# EAGLE board matrix2 (EAGLE 5.10), part 1 of 2
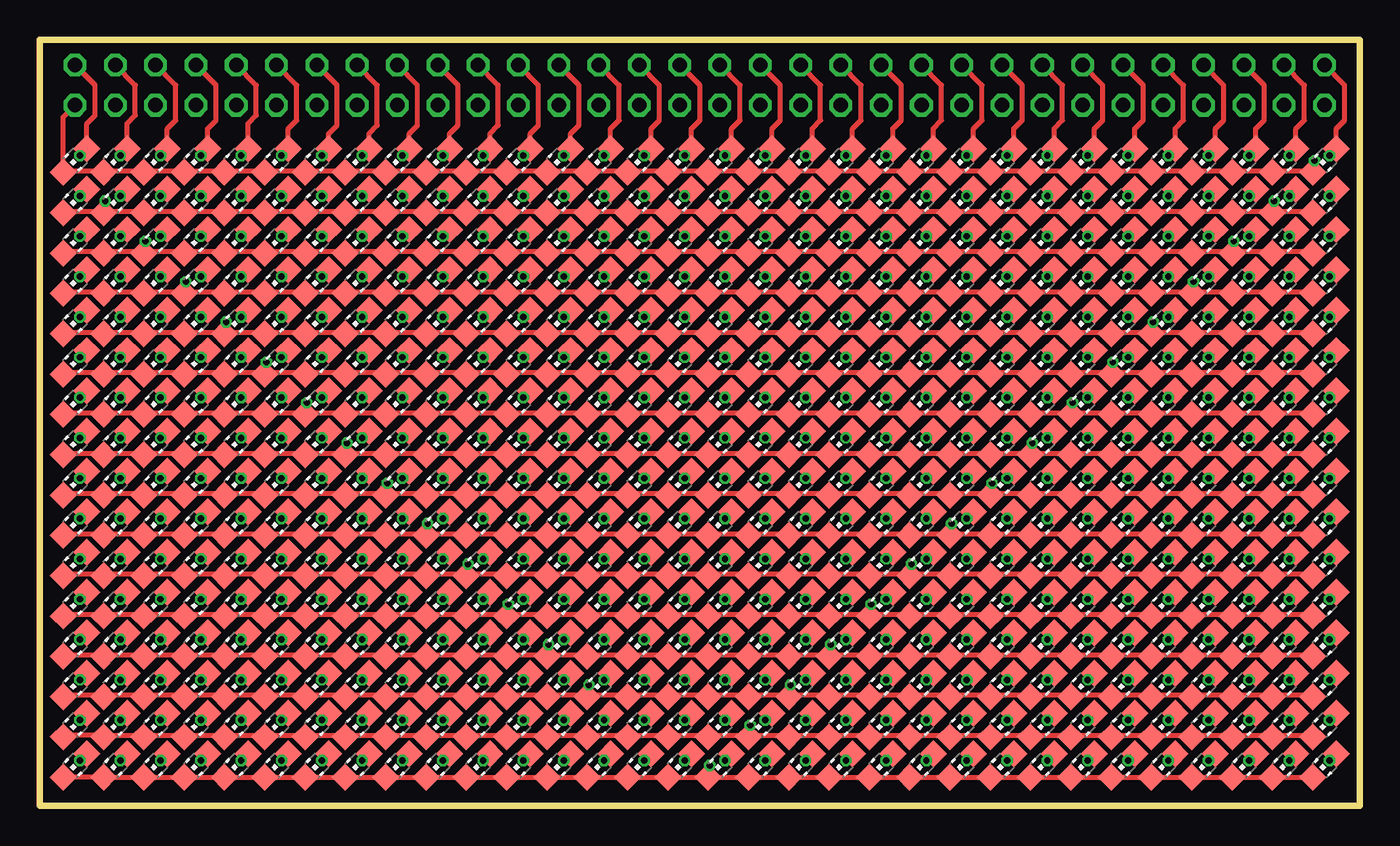
[diagram p1: board, top side]
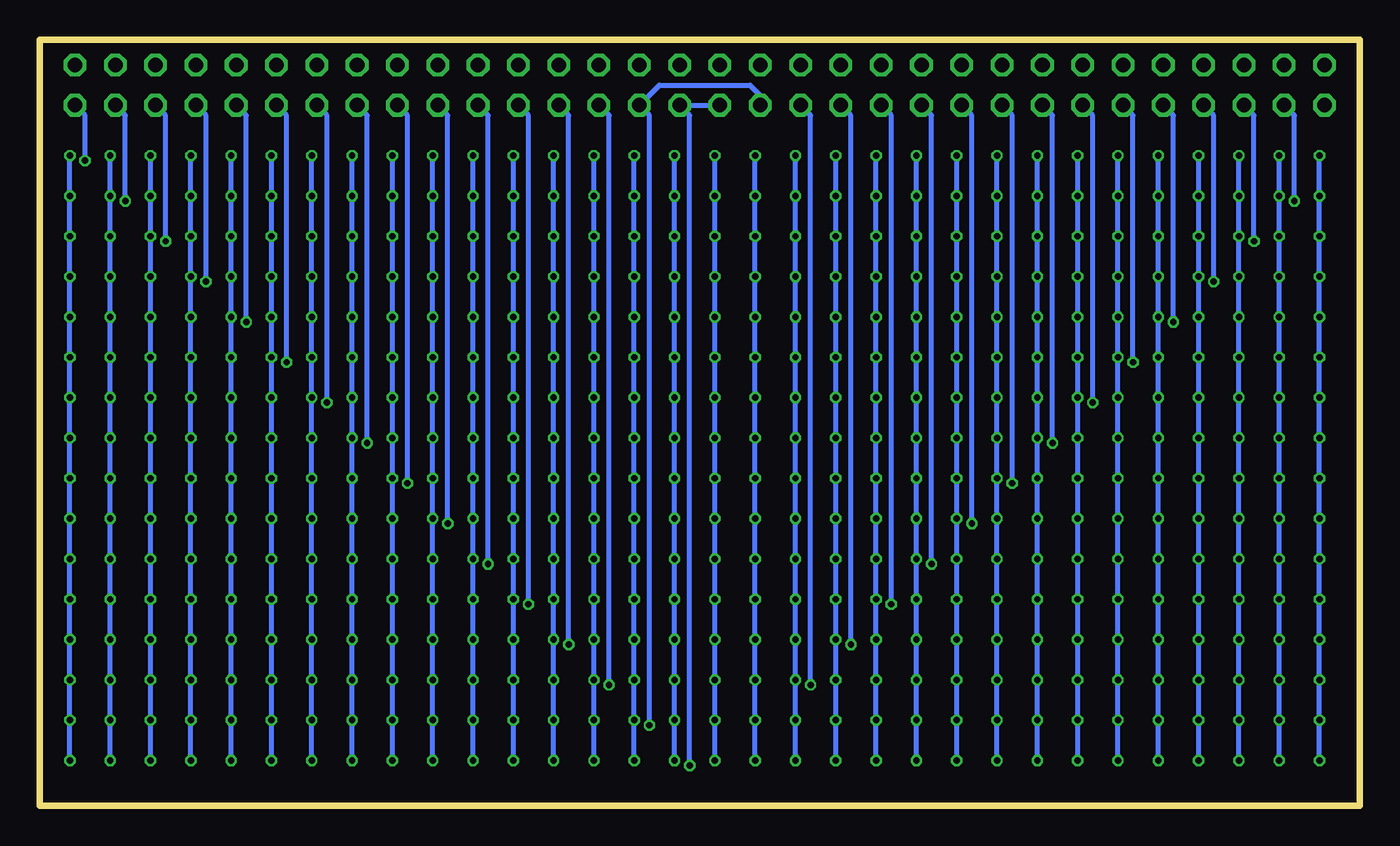
[diagram p2: board, bottom side, seen from below]

Size 83.19 x 48.26 mm. Coordinates in mm from the lower left corner, seen from the top.
Outline: 0,0 83.19,0 83.19,48.26 0,48.26 0,0
Copper layers (1*16): Top 0.035mm / dielectric 1.5mm / Bottom 0.035mm
Design rules "ITEADstudio_DRC": minimum track width 6mil, minimum drill 12mil, track to track 6mil, track to pad 6mil, pad to pad 6mil, via to via 6mil, smd to smd 0mil, copper to edge 10mil, drill to drill 10mil, minimum pad ring 10mil, minimum via ring 6mil, stop-mask expansion 2mil, vias tented up to drill 100mil, thermal gap 10mil

## Footprints (pad centres in the part's own frame; a part is rotated, then mirrored left to right if it is on the bottom)
CHIP-LED0805 = smd 1.2 x 1.2: A 0,-1.05; C 0,1.05
ML64_K = drill 0.914 octagon: 1 -39.37,-1.27; 2 -39.37,1.27; 3 -36.83,-1.27; 4 -36.83,1.27; 5 -34.29,-1.27; 6 -34.29,1.27; 7 -31.75,-1.27; 8 -31.75,1.27; 9 -29.21,-1.27; 10 -29.21,1.27; 11 -26.67,-1.27; 12 -26.67,1.27; 13 -24.13,-1.27; 14 -24.13,1.27; 15 -21.59,-1.27; 16 -21.59,1.27; 17 -19.05,-1.27; 18 -19.05,1.27; 19 -16.51,-1.27; 20 -16.51,1.27; 21 -13.97,-1.27; 22 -13.97,1.27; 23 -11.43,-1.27; 24 -11.43,1.27; 25 -8.89,-1.27; 26 -8.89,1.27; 27 -6.35,-1.27; 28 -6.35,1.27; 29 -3.81,-1.27; 30 -3.81,1.27; 31 -1.27,-1.27; 32 -1.27,1.27; 33 1.27,-1.27; 34 1.27,1.27; 35 3.81,-1.27; 36 3.81,1.27; 37 6.35,-1.27; 38 6.35,1.27; 39 8.89,-1.27; 40 8.89,1.27; 41 11.43,-1.27; 42 11.43,1.27; 43 13.97,-1.27; 44 13.97,1.27; 45 16.51,-1.27; 46 16.51,1.27; 47 19.05,-1.27; 48 19.05,1.27; 49 21.59,-1.27; 50 21.59,1.27; 51 24.13,-1.27; 52 24.13,1.27; 53 26.67,-1.27; 54 26.67,1.27; 55 29.21,-1.27; 56 29.21,1.27; 57 31.75,-1.27; 58 31.75,1.27; 59 34.29,-1.27; 60 34.29,1.27; 61 36.83,-1.27; 62 36.83,1.27; 63 39.37,-1.27; 64 39.37,1.27

## Placement (x,y rotation side)
LED1  [CHIP-LED0805]  2.22,2.54 135 top
LED2  [CHIP-LED0805]  2.22,5.08 135 top
LED3  [CHIP-LED0805]  2.22,7.62 135 top
LED4  [CHIP-LED0805]  2.22,10.16 135 top
LED5  [CHIP-LED0805]  4.76,2.54 135 top
LED6  [CHIP-LED0805]  4.76,5.08 135 top
LED7  [CHIP-LED0805]  4.76,7.62 135 top
LED8  [CHIP-LED0805]  4.76,10.16 135 top
LED9  [CHIP-LED0805]  4.76,12.7 135 top
LED10  [CHIP-LED0805]  4.76,15.24 135 top
LED11  [CHIP-LED0805]  4.76,17.78 135 top
LED12  [CHIP-LED0805]  4.76,20.32 135 top
LED13  [CHIP-LED0805]  4.76,22.86 135 top
LED14  [CHIP-LED0805]  4.76,25.4 135 top
LED15  [CHIP-LED0805]  4.76,27.94 135 top
LED16  [CHIP-LED0805]  4.76,30.48 135 top
LED17  [CHIP-LED0805]  2.22,12.7 135 top
LED18  [CHIP-LED0805]  2.22,15.24 135 top
LED19  [CHIP-LED0805]  2.22,17.78 135 top
LED20  [CHIP-LED0805]  2.22,20.32 135 top
LED21  [CHIP-LED0805]  4.76,35.56 135 top
LED22  [CHIP-LED0805]  4.76,38.1 135 top
LED23  [CHIP-LED0805]  4.76,40.64 135 top
LED24  [CHIP-LED0805]  4.76,33.02 135 top
LED25  [CHIP-LED0805]  7.3,2.54 135 top
LED26  [CHIP-LED0805]  7.3,5.08 135 top
LED27  [CHIP-LED0805]  7.3,7.62 135 top
LED28  [CHIP-LED0805]  7.3,10.16 135 top
LED29  [CHIP-LED0805]  7.3,12.7 135 top
LED30  [CHIP-LED0805]  7.3,15.24 135 top
LED31  [CHIP-LED0805]  7.3,17.78 135 top
LED32  [CHIP-LED0805]  7.3,20.32 135 top
LED33  [CHIP-LED0805]  2.22,22.86 135 top
LED34  [CHIP-LED0805]  2.22,25.4 135 top
LED35  [CHIP-LED0805]  2.22,27.94 135 top
LED36  [CHIP-LED0805]  2.22,30.48 135 top
LED37  [CHIP-LED0805]  7.3,22.86 135 top
LED38  [CHIP-LED0805]  7.3,25.4 135 top
LED39  [CHIP-LED0805]  7.3,27.94 135 top
LED40  [CHIP-LED0805]  7.3,30.48 135 top
LED41  [CHIP-LED0805]  7.3,35.56 135 top
LED42  [CHIP-LED0805]  7.3,38.1 135 top
LED43  [CHIP-LED0805]  7.3,40.64 135 top
LED44  [CHIP-LED0805]  7.3,33.02 135 top
LED45  [CHIP-LED0805]  9.84,2.54 135 top
LED46  [CHIP-LED0805]  9.84,5.08 135 top
LED47  [CHIP-LED0805]  9.84,7.62 135 top
LED48  [CHIP-LED0805]  9.84,10.16 135 top
LED49  [CHIP-LED0805]  9.84,12.7 135 top
LED50  [CHIP-LED0805]  9.84,15.24 135 top
LED51  [CHIP-LED0805]  9.84,17.78 135 top
LED52  [CHIP-LED0805]  9.84,20.32 135 top
LED53  [CHIP-LED0805]  9.84,22.86 135 top
LED54  [CHIP-LED0805]  9.84,25.4 135 top
LED55  [CHIP-LED0805]  9.84,27.94 135 top
LED56  [CHIP-LED0805]  9.84,30.48 135 top
LED57  [CHIP-LED0805]  9.84,35.56 135 top
LED58  [CHIP-LED0805]  9.84,38.1 135 top
LED59  [CHIP-LED0805]  9.84,40.64 135 top
LED60  [CHIP-LED0805]  9.84,33.02 135 top
LED61  [CHIP-LED0805]  12.38,2.54 135 top
LED62  [CHIP-LED0805]  12.38,5.08 135 top
LED63  [CHIP-LED0805]  12.38,7.62 135 top
LED64  [CHIP-LED0805]  12.38,10.16 135 top
LED65  [CHIP-LED0805]  2.22,35.56 135 top
LED66  [CHIP-LED0805]  2.22,38.1 135 top
LED67  [CHIP-LED0805]  2.22,40.64 135 top
LED68  [CHIP-LED0805]  2.22,33.02 135 top
LED69  [CHIP-LED0805]  12.38,12.7 135 top
LED70  [CHIP-LED0805]  12.38,15.24 135 top
LED71  [CHIP-LED0805]  12.38,17.78 135 top
LED72  [CHIP-LED0805]  12.38,20.32 135 top
LED73  [CHIP-LED0805]  12.38,22.86 135 top
LED74  [CHIP-LED0805]  12.38,25.4 135 top
LED75  [CHIP-LED0805]  12.38,27.94 135 top
LED76  [CHIP-LED0805]  12.38,30.48 135 top
LED77  [CHIP-LED0805]  12.38,35.56 135 top
LED78  [CHIP-LED0805]  12.38,38.1 135 top
LED79  [CHIP-LED0805]  12.38,40.64 135 top
LED80  [CHIP-LED0805]  12.38,33.02 135 top
LED81  [CHIP-LED0805]  14.92,2.54 135 top
LED82  [CHIP-LED0805]  14.92,5.08 135 top
LED83  [CHIP-LED0805]  14.92,7.62 135 top
LED84  [CHIP-LED0805]  14.92,10.16 135 top
LED85  [CHIP-LED0805]  14.92,12.7 135 top
LED86  [CHIP-LED0805]  14.92,15.24 135 top
LED87  [CHIP-LED0805]  14.92,17.78 135 top
LED88  [CHIP-LED0805]  14.92,20.32 135 top
LED89  [CHIP-LED0805]  14.92,22.86 135 top
LED90  [CHIP-LED0805]  14.92,25.4 135 top
LED91  [CHIP-LED0805]  14.92,27.94 135 top
LED92  [CHIP-LED0805]  14.92,30.48 135 top
LED93  [CHIP-LED0805]  14.92,35.56 135 top
LED94  [CHIP-LED0805]  14.92,38.1 135 top
LED95  [CHIP-LED0805]  14.92,40.64 135 top
LED96  [CHIP-LED0805]  14.92,33.02 135 top
LED97  [CHIP-LED0805]  17.46,2.54 135 top
LED98  [CHIP-LED0805]  17.46,5.08 135 top
LED99  [CHIP-LED0805]  17.46,7.62 135 top
LED100  [CHIP-LED0805]  17.46,10.16 135 top
LED101  [CHIP-LED0805]  17.46,12.7 135 top
LED102  [CHIP-LED0805]  17.46,15.24 135 top
LED103  [CHIP-LED0805]  17.46,17.78 135 top
LED104  [CHIP-LED0805]  17.46,20.32 135 top
LED105  [CHIP-LED0805]  17.46,22.86 135 top
LED106  [CHIP-LED0805]  17.46,25.4 135 top
LED107  [CHIP-LED0805]  17.46,27.94 135 top
LED108  [CHIP-LED0805]  17.46,30.48 135 top
LED109  [CHIP-LED0805]  17.46,35.56 135 top
LED110  [CHIP-LED0805]  17.46,38.1 135 top
LED111  [CHIP-LED0805]  17.46,40.64 135 top
LED112  [CHIP-LED0805]  17.46,33.02 135 top
LED113  [CHIP-LED0805]  20,2.54 135 top
LED114  [CHIP-LED0805]  20,5.08 135 top
LED115  [CHIP-LED0805]  20,7.62 135 top
LED116  [CHIP-LED0805]  20,10.16 135 top
LED117  [CHIP-LED0805]  20,12.7 135 top
LED118  [CHIP-LED0805]  20,15.24 135 top
LED119  [CHIP-LED0805]  20,17.78 135 top
LED120  [CHIP-LED0805]  20,20.32 135 top
LED121  [CHIP-LED0805]  20,22.86 135 top
LED122  [CHIP-LED0805]  20,25.4 135 top
LED123  [CHIP-LED0805]  20,27.94 135 top
LED124  [CHIP-LED0805]  20,30.48 135 top
LED125  [CHIP-LED0805]  20,35.56 135 top
LED126  [CHIP-LED0805]  20,38.1 135 top
LED127  [CHIP-LED0805]  20,40.64 135 top
LED128  [CHIP-LED0805]  20,33.02 135 top
LED129  [CHIP-LED0805]  22.54,2.54 135 top
LED130  [CHIP-LED0805]  22.54,5.08 135 top
LED131  [CHIP-LED0805]  22.54,7.62 135 top
LED132  [CHIP-LED0805]  22.54,10.16 135 top
LED133  [CHIP-LED0805]  22.54,12.7 135 top
LED134  [CHIP-LED0805]  22.54,15.24 135 top
LED135  [CHIP-LED0805]  22.54,17.78 135 top
LED136  [CHIP-LED0805]  22.54,20.32 135 top
LED137  [CHIP-LED0805]  22.54,22.86 135 top
LED138  [CHIP-LED0805]  22.54,25.4 135 top
LED139  [CHIP-LED0805]  22.54,27.94 135 top
LED140  [CHIP-LED0805]  22.54,30.48 135 top
LED141  [CHIP-LED0805]  22.54,35.56 135 top
LED142  [CHIP-LED0805]  22.54,38.1 135 top
LED143  [CHIP-LED0805]  22.54,40.64 135 top
LED144  [CHIP-LED0805]  22.54,33.02 135 top
LED145  [CHIP-LED0805]  25.08,2.54 135 top
LED146  [CHIP-LED0805]  25.08,5.08 135 top
LED147  [CHIP-LED0805]  25.08,7.62 135 top
LED148  [CHIP-LED0805]  25.08,10.16 135 top
LED149  [CHIP-LED0805]  25.08,12.7 135 top
LED150  [CHIP-LED0805]  25.08,15.24 135 top
LED151  [CHIP-LED0805]  25.08,17.78 135 top
LED152  [CHIP-LED0805]  25.08,20.32 135 top
LED153  [CHIP-LED0805]  25.08,22.86 135 top
LED154  [CHIP-LED0805]  25.08,25.4 135 top
LED155  [CHIP-LED0805]  25.08,27.94 135 top
LED156  [CHIP-LED0805]  25.08,30.48 135 top
LED157  [CHIP-LED0805]  25.08,35.56 135 top
LED158  [CHIP-LED0805]  25.08,38.1 135 top
LED159  [CHIP-LED0805]  25.08,40.64 135 top
LED160  [CHIP-LED0805]  25.08,33.02 135 top
LED161  [CHIP-LED0805]  27.62,2.54 135 top
LED162  [CHIP-LED0805]  27.62,5.08 135 top
LED163  [CHIP-LED0805]  27.62,7.62 135 top
LED164  [CHIP-LED0805]  27.62,10.16 135 top
LED165  [CHIP-LED0805]  27.62,12.7 135 top
LED166  [CHIP-LED0805]  27.62,15.24 135 top
LED167  [CHIP-LED0805]  27.62,17.78 135 top
LED168  [CHIP-LED0805]  27.62,20.32 135 top
LED169  [CHIP-LED0805]  27.62,22.86 135 top
LED170  [CHIP-LED0805]  27.62,25.4 135 top
LED171  [CHIP-LED0805]  27.62,27.94 135 top
LED172  [CHIP-LED0805]  27.62,30.48 135 top
LED173  [CHIP-LED0805]  27.62,35.56 135 top
LED174  [CHIP-LED0805]  27.62,38.1 135 top
LED175  [CHIP-LED0805]  27.62,40.64 135 top
LED176  [CHIP-LED0805]  27.62,33.02 135 top
LED177  [CHIP-LED0805]  30.16,2.54 135 top
LED178  [CHIP-LED0805]  30.16,5.08 135 top
LED179  [CHIP-LED0805]  30.16,7.62 135 top
LED180  [CHIP-LED0805]  30.16,10.16 135 top
LED181  [CHIP-LED0805]  30.16,12.7 135 top
LED182  [CHIP-LED0805]  30.16,15.24 135 top
LED183  [CHIP-LED0805]  30.16,17.78 135 top
LED184  [CHIP-LED0805]  30.16,20.32 135 top
LED185  [CHIP-LED0805]  30.16,22.86 135 top
LED186  [CHIP-LED0805]  30.16,25.4 135 top
LED187  [CHIP-LED0805]  30.16,27.94 135 top
LED188  [CHIP-LED0805]  30.16,30.48 135 top
LED189  [CHIP-LED0805]  30.16,35.56 135 top
LED190  [CHIP-LED0805]  30.16,38.1 135 top
LED191  [CHIP-LED0805]  30.16,40.64 135 top
LED192  [CHIP-LED0805]  30.16,33.02 135 top
LED193  [CHIP-LED0805]  32.7,2.54 135 top
LED194  [CHIP-LED0805]  32.7,5.08 135 top
LED195  [CHIP-LED0805]  32.7,7.62 135 top
LED196  [CHIP-LED0805]  32.7,10.16 135 top
LED197  [CHIP-LED0805]  32.7,12.7 135 top
LED198  [CHIP-LED0805]  32.7,15.24 135 top
LED199  [CHIP-LED0805]  32.7,17.78 135 top
LED200  [CHIP-LED0805]  32.7,20.32 135 top
LED201  [CHIP-LED0805]  32.7,22.86 135 top
LED202  [CHIP-LED0805]  32.7,25.4 135 top
LED203  [CHIP-LED0805]  32.7,27.94 135 top
LED204  [CHIP-LED0805]  32.7,30.48 135 top
LED205  [CHIP-LED0805]  32.7,35.56 135 top
LED206  [CHIP-LED0805]  32.7,38.1 135 top
LED207  [CHIP-LED0805]  32.7,40.64 135 top
LED208  [CHIP-LED0805]  32.7,33.02 135 top
LED209  [CHIP-LED0805]  35.24,2.54 135 top
LED210  [CHIP-LED0805]  35.24,5.08 135 top
LED211  [CHIP-LED0805]  35.24,7.62 135 top
LED212  [CHIP-LED0805]  35.24,10.16 135 top
LED213  [CHIP-LED0805]  35.24,12.7 135 top
LED214  [CHIP-LED0805]  35.24,15.24 135 top
LED215  [CHIP-LED0805]  35.24,17.78 135 top
LED216  [CHIP-LED0805]  35.24,20.32 135 top
LED217  [CHIP-LED0805]  35.24,22.86 135 top
LED218  [CHIP-LED0805]  35.24,25.4 135 top
LED219  [CHIP-LED0805]  35.24,27.94 135 top
LED220  [CHIP-LED0805]  35.24,30.48 135 top
LED221  [CHIP-LED0805]  35.24,35.56 135 top
LED222  [CHIP-LED0805]  35.24,38.1 135 top
LED223  [CHIP-LED0805]  35.24,40.64 135 top
LED224  [CHIP-LED0805]  35.24,33.02 135 top
LED225  [CHIP-LED0805]  37.78,2.54 135 top
LED226  [CHIP-LED0805]  37.78,5.08 135 top
LED227  [CHIP-LED0805]  37.78,7.62 135 top
LED228  [CHIP-LED0805]  37.78,10.16 135 top
LED229  [CHIP-LED0805]  37.78,12.7 135 top
LED230  [CHIP-LED0805]  37.78,15.24 135 top
LED231  [CHIP-LED0805]  37.78,17.78 135 top
LED232  [CHIP-LED0805]  37.78,20.32 135 top
LED233  [CHIP-LED0805]  37.78,22.86 135 top
LED234  [CHIP-LED0805]  37.78,25.4 135 top
LED235  [CHIP-LED0805]  37.78,27.94 135 top
LED236  [CHIP-LED0805]  37.78,30.48 135 top
LED237  [CHIP-LED0805]  37.78,35.56 135 top
LED238  [CHIP-LED0805]  37.78,38.1 135 top
LED239  [CHIP-LED0805]  37.78,40.64 135 top
LED240  [CHIP-LED0805]  37.78,33.02 135 top
LED241  [CHIP-LED0805]  40.32,2.54 135 top
LED242  [CHIP-LED0805]  40.32,5.08 135 top
LED243  [CHIP-LED0805]  40.32,7.62 135 top
LED244  [CHIP-LED0805]  40.32,10.16 135 top
LED245  [CHIP-LED0805]  40.32,12.7 135 top
LED246  [CHIP-LED0805]  40.32,15.24 135 top
LED247  [CHIP-LED0805]  40.32,17.78 135 top
LED248  [CHIP-LED0805]  40.32,20.32 135 top
LED249  [CHIP-LED0805]  40.32,22.86 135 top
LED250  [CHIP-LED0805]  40.32,25.4 135 top
LED251  [CHIP-LED0805]  40.32,27.94 135 top
LED252  [CHIP-LED0805]  40.32,30.48 135 top
LED253  [CHIP-LED0805]  40.32,35.56 135 top
LED254  [CHIP-LED0805]  40.32,38.1 135 top
LED255  [CHIP-LED0805]  40.32,40.64 135 top
LED256  [CHIP-LED0805]  40.32,33.02 135 top
LED257  [CHIP-LED0805]  42.86,2.54 135 top
LED258  [CHIP-LED0805]  42.86,5.08 135 top
LED259  [CHIP-LED0805]  42.86,7.62 135 top
LED260  [CHIP-LED0805]  42.86,10.16 135 top
LED261  [CHIP-LED0805]  42.86,12.7 135 top
LED262  [CHIP-LED0805]  42.86,15.24 135 top
LED263  [CHIP-LED0805]  42.86,17.78 135 top
LED264  [CHIP-LED0805]  42.86,20.32 135 top
LED265  [CHIP-LED0805]  42.86,22.86 135 top
LED266  [CHIP-LED0805]  42.86,25.4 135 top
LED267  [CHIP-LED0805]  42.86,27.94 135 top
LED268  [CHIP-LED0805]  42.86,30.48 135 top
LED269  [CHIP-LED0805]  42.86,35.56 135 top
LED270  [CHIP-LED0805]  42.86,38.1 135 top
LED271  [CHIP-LED0805]  42.86,40.64 135 top
LED272  [CHIP-LED0805]  42.86,33.02 135 top
LED273  [CHIP-LED0805]  45.4,2.54 135 top
LED274  [CHIP-LED0805]  45.4,5.08 135 top
LED275  [CHIP-LED0805]  45.4,7.62 135 top
LED276  [CHIP-LED0805]  45.4,10.16 135 top
LED277  [CHIP-LED0805]  45.4,12.7 135 top
LED278  [CHIP-LED0805]  45.4,15.24 135 top
LED279  [CHIP-LED0805]  45.4,17.78 135 top
LED280  [CHIP-LED0805]  45.4,20.32 135 top
LED281  [CHIP-LED0805]  45.4,22.86 135 top
LED282  [CHIP-LED0805]  45.4,25.4 135 top
LED283  [CHIP-LED0805]  45.4,27.94 135 top
LED284  [CHIP-LED0805]  45.4,30.48 135 top
LED285  [CHIP-LED0805]  45.4,35.56 135 top
LED286  [CHIP-LED0805]  45.4,38.1 135 top
LED287  [CHIP-LED0805]  45.4,40.64 135 top
LED288  [CHIP-LED0805]  45.4,33.02 135 top
LED289  [CHIP-LED0805]  47.94,2.54 135 top
LED290  [CHIP-LED0805]  47.94,5.08 135 top
LED291  [CHIP-LED0805]  47.94,7.62 135 top
LED292  [CHIP-LED0805]  47.94,10.16 135 top
LED293  [CHIP-LED0805]  47.94,12.7 135 top
LED294  [CHIP-LED0805]  47.94,15.24 135 top
LED295  [CHIP-LED0805]  47.94,17.78 135 top
LED296  [CHIP-LED0805]  47.94,20.32 135 top
LED297  [CHIP-LED0805]  47.94,22.86 135 top
LED298  [CHIP-LED0805]  47.94,25.4 135 top
LED299  [CHIP-LED0805]  47.94,27.94 135 top
LED300  [CHIP-LED0805]  47.94,30.48 135 top
LED301  [CHIP-LED0805]  47.94,35.56 135 top
LED302  [CHIP-LED0805]  47.94,38.1 135 top
LED303  [CHIP-LED0805]  47.94,40.64 135 top
LED304  [CHIP-LED0805]  47.94,33.02 135 top
LED305  [CHIP-LED0805]  50.48,2.54 135 top
LED306  [CHIP-LED0805]  50.48,5.08 135 top
LED307  [CHIP-LED0805]  50.48,7.62 135 top
LED308  [CHIP-LED0805]  50.48,10.16 135 top
LED309  [CHIP-LED0805]  50.48,12.7 135 top
LED310  [CHIP-LED0805]  50.48,15.24 135 top
LED311  [CHIP-LED0805]  50.48,17.78 135 top
LED312  [CHIP-LED0805]  50.48,20.32 135 top
LED313  [CHIP-LED0805]  50.48,22.86 135 top
LED314  [CHIP-LED0805]  50.48,25.4 135 top
LED315  [CHIP-LED0805]  50.48,27.94 135 top
LED316  [CHIP-LED0805]  50.48,30.48 135 top
LED317  [CHIP-LED0805]  50.48,35.56 135 top
LED318  [CHIP-LED0805]  50.48,38.1 135 top
LED319  [CHIP-LED0805]  50.48,40.64 135 top
LED320  [CHIP-LED0805]  50.48,33.02 135 top
LED321  [CHIP-LED0805]  53.02,2.54 135 top
LED322  [CHIP-LED0805]  53.02,5.08 135 top
LED323  [CHIP-LED0805]  53.02,7.62 135 top
LED324  [CHIP-LED0805]  53.02,10.16 135 top
LED325  [CHIP-LED0805]  53.02,12.7 135 top
LED326  [CHIP-LED0805]  53.02,15.24 135 top
LED327  [CHIP-LED0805]  53.02,17.78 135 top
LED328  [CHIP-LED0805]  53.02,20.32 135 top
LED329  [CHIP-LED0805]  53.02,22.86 135 top
LED330  [CHIP-LED0805]  53.02,25.4 135 top
LED331  [CHIP-LED0805]  53.02,27.94 135 top
LED332  [CHIP-LED0805]  53.02,30.48 135 top
LED333  [CHIP-LED0805]  53.02,35.56 135 top
LED334  [CHIP-LED0805]  53.02,38.1 135 top
LED335  [CHIP-LED0805]  53.02,40.64 135 top
LED336  [CHIP-LED0805]  53.02,33.02 135 top
LED337  [CHIP-LED0805]  55.56,2.54 135 top
LED338  [CHIP-LED0805]  55.56,5.08 135 top
LED339  [CHIP-LED0805]  55.56,7.62 135 top
LED340  [CHIP-LED0805]  55.56,10.16 135 top
LED341  [CHIP-LED0805]  55.56,12.7 135 top
LED342  [CHIP-LED0805]  55.56,15.24 135 top
LED343  [CHIP-LED0805]  55.56,17.78 135 top
LED344  [CHIP-LED0805]  55.56,20.32 135 top
LED345  [CHIP-LED0805]  55.56,22.86 135 top
LED346  [CHIP-LED0805]  55.56,25.4 135 top
LED347  [CHIP-LED0805]  55.56,27.94 135 top
LED348  [CHIP-LED0805]  55.56,30.48 135 top
LED349  [CHIP-LED0805]  55.56,35.56 135 top
LED350  [CHIP-LED0805]  55.56,38.1 135 top
LED351  [CHIP-LED0805]  55.56,40.64 135 top
LED352  [CHIP-LED0805]  55.56,33.02 135 top
LED353  [CHIP-LED0805]  58.1,2.54 135 top
LED354  [CHIP-LED0805]  58.1,5.08 135 top
LED355  [CHIP-LED0805]  58.1,7.62 135 top
LED356  [CHIP-LED0805]  58.1,10.16 135 top
LED357  [CHIP-LED0805]  58.1,12.7 135 top
LED358  [CHIP-LED0805]  58.1,15.24 135 top
LED359  [CHIP-LED0805]  58.1,17.78 135 top
LED360  [CHIP-LED0805]  58.1,20.32 135 top
LED361  [CHIP-LED0805]  58.1,22.86 135 top
LED362  [CHIP-LED0805]  58.1,25.4 135 top
LED363  [CHIP-LED0805]  58.1,27.94 135 top
LED364  [CHIP-LED0805]  58.1,30.48 135 top
LED365  [CHIP-LED0805]  58.1,35.56 135 top
LED366  [CHIP-LED0805]  58.1,38.1 135 top
LED367  [CHIP-LED0805]  58.1,40.64 135 top
LED368  [CHIP-LED0805]  58.1,33.02 135 top
LED369  [CHIP-LED0805]  60.64,2.54 135 top
LED370  [CHIP-LED0805]  60.64,5.08 135 top
LED371  [CHIP-LED0805]  60.64,7.62 135 top
LED372  [CHIP-LED0805]  60.64,10.16 135 top
LED373  [CHIP-LED0805]  60.64,12.7 135 top
LED374  [CHIP-LED0805]  60.64,15.24 135 top
LED375  [CHIP-LED0805]  60.64,17.78 135 top
LED376  [CHIP-LED0805]  60.64,20.32 135 top
LED377  [CHIP-LED0805]  60.64,22.86 135 top
LED378  [CHIP-LED0805]  60.64,25.4 135 top
LED379  [CHIP-LED0805]  60.64,27.94 135 top
LED380  [CHIP-LED0805]  60.64,30.48 135 top
LED381  [CHIP-LED0805]  60.64,35.56 135 top
LED382  [CHIP-LED0805]  60.64,38.1 135 top
LED383  [CHIP-LED0805]  60.64,40.64 135 top
LED384  [CHIP-LED0805]  60.64,33.02 135 top
LED385  [CHIP-LED0805]  63.18,2.54 135 top
LED386  [CHIP-LED0805]  63.18,5.08 135 top
LED387  [CHIP-LED0805]  63.18,7.62 135 top
LED388  [CHIP-LED0805]  63.18,10.16 135 top
LED389  [CHIP-LED0805]  63.18,12.7 135 top
LED390  [CHIP-LED0805]  63.18,15.24 135 top
LED391  [CHIP-LED0805]  63.18,17.78 135 top
LED392  [CHIP-LED0805]  63.18,20.32 135 top
LED393  [CHIP-LED0805]  63.18,22.86 135 top
LED394  [CHIP-LED0805]  63.18,25.4 135 top
LED395  [CHIP-LED0805]  63.18,27.94 135 top
LED396  [CHIP-LED0805]  63.18,30.48 135 top
LED397  [CHIP-LED0805]  63.18,35.56 135 top
LED398  [CHIP-LED0805]  63.18,38.1 135 top
LED399  [CHIP-LED0805]  63.18,40.64 135 top
LED400  [CHIP-LED0805]  63.18,33.02 135 top
LED401  [CHIP-LED0805]  65.72,2.54 135 top
LED402  [CHIP-LED0805]  65.72,5.08 135 top
LED403  [CHIP-LED0805]  65.72,7.62 135 top
LED404  [CHIP-LED0805]  65.72,10.16 135 top
LED405  [CHIP-LED0805]  65.72,12.7 135 top
LED406  [CHIP-LED0805]  65.72,15.24 135 top
LED407  [CHIP-LED0805]  65.72,17.78 135 top
LED408  [CHIP-LED0805]  65.72,20.32 135 top
LED409  [CHIP-LED0805]  65.72,22.86 135 top
LED410  [CHIP-LED0805]  65.72,25.4 135 top
LED411  [CHIP-LED0805]  65.72,27.94 135 top
LED412  [CHIP-LED0805]  65.72,30.48 135 top
LED413  [CHIP-LED0805]  65.72,35.56 135 top
LED414  [CHIP-LED0805]  65.72,38.1 135 top
LED415  [CHIP-LED0805]  65.72,40.64 135 top
LED416  [CHIP-LED0805]  65.72,33.02 135 top
LED417  [CHIP-LED0805]  68.26,2.54 135 top
LED418  [CHIP-LED0805]  68.26,5.08 135 top
LED419  [CHIP-LED0805]  68.26,7.62 135 top
LED420  [CHIP-LED0805]  68.26,10.16 135 top
LED421  [CHIP-LED0805]  68.26,12.7 135 top
LED422  [CHIP-LED0805]  68.26,15.24 135 top
LED423  [CHIP-LED0805]  68.26,17.78 135 top
LED424  [CHIP-LED0805]  68.26,20.32 135 top
LED425  [CHIP-LED0805]  68.26,22.86 135 top
LED426  [CHIP-LED0805]  68.26,25.4 135 top
LED427  [CHIP-LED0805]  68.26,27.94 135 top
LED428  [CHIP-LED0805]  68.26,30.48 135 top
LED429  [CHIP-LED0805]  68.26,35.56 135 top
LED430  [CHIP-LED0805]  68.26,38.1 135 top
LED431  [CHIP-LED0805]  68.26,40.64 135 top
LED432  [CHIP-LED0805]  68.26,33.02 135 top
LED433  [CHIP-LED0805]  70.8,2.54 135 top
LED434  [CHIP-LED0805]  70.8,5.08 135 top
LED435  [CHIP-LED0805]  70.8,7.62 135 top
LED436  [CHIP-LED0805]  70.8,10.16 135 top
LED437  [CHIP-LED0805]  70.8,12.7 135 top
LED438  [CHIP-LED0805]  70.8,15.24 135 top
LED439  [CHIP-LED0805]  70.8,17.78 135 top
LED440  [CHIP-LED0805]  70.8,20.32 135 top
LED441  [CHIP-LED0805]  70.8,22.86 135 top
LED442  [CHIP-LED0805]  70.8,25.4 135 top
LED443  [CHIP-LED0805]  70.8,27.94 135 top
LED444  [CHIP-LED0805]  70.8,30.48 135 top
LED445  [CHIP-LED0805]  70.8,35.56 135 top
LED446  [CHIP-LED0805]  70.8,38.1 135 top
LED447  [CHIP-LED0805]  70.8,40.64 135 top
LED448  [CHIP-LED0805]  70.8,33.02 135 top
LED449  [CHIP-LED0805]  73.34,2.54 135 top
LED450  [CHIP-LED0805]  73.34,5.08 135 top
LED451  [CHIP-LED0805]  73.34,7.62 135 top
LED452  [CHIP-LED0805]  73.34,10.16 135 top
LED453  [CHIP-LED0805]  73.34,12.7 135 top
LED454  [CHIP-LED0805]  73.34,15.24 135 top
LED455  [CHIP-LED0805]  73.34,17.78 135 top
LED456  [CHIP-LED0805]  73.34,20.32 135 top
LED457  [CHIP-LED0805]  73.34,22.86 135 top
LED458  [CHIP-LED0805]  73.34,25.4 135 top
LED459  [CHIP-LED0805]  73.34,27.94 135 top
LED460  [CHIP-LED0805]  73.34,30.48 135 top
LED461  [CHIP-LED0805]  73.34,35.56 135 top
LED462  [CHIP-LED0805]  73.34,38.1 135 top
LED463  [CHIP-LED0805]  73.34,40.64 135 top
LED464  [CHIP-LED0805]  73.34,33.02 135 top
LED465  [CHIP-LED0805]  75.88,2.54 135 top
LED466  [CHIP-LED0805]  75.88,5.08 135 top
LED467  [CHIP-LED0805]  75.88,7.62 135 top
LED468  [CHIP-LED0805]  75.88,10.16 135 top
LED469  [CHIP-LED0805]  75.88,12.7 135 top
LED470  [CHIP-LED0805]  75.88,15.24 135 top
LED471  [CHIP-LED0805]  75.88,17.78 135 top
LED472  [CHIP-LED0805]  75.88,20.32 135 top
LED473  [CHIP-LED0805]  75.88,22.86 135 top
LED474  [CHIP-LED0805]  75.88,25.4 135 top
LED475  [CHIP-LED0805]  75.88,27.94 135 top
LED476  [CHIP-LED0805]  75.88,30.48 135 top
LED477  [CHIP-LED0805]  75.88,35.56 135 top
LED478  [CHIP-LED0805]  75.88,38.1 135 top
LED479  [CHIP-LED0805]  75.88,40.64 135 top
LED480  [CHIP-LED0805]  75.88,33.02 135 top
LED481  [CHIP-LED0805]  78.42,2.54 135 top
LED482  [CHIP-LED0805]  78.42,5.08 135 top
LED483  [CHIP-LED0805]  78.42,7.62 135 top
LED484  [CHIP-LED0805]  78.42,10.16 135 top
LED485  [CHIP-LED0805]  78.42,12.7 135 top
LED486  [CHIP-LED0805]  78.42,15.24 135 top
LED487  [CHIP-LED0805]  78.42,17.78 135 top
LED488  [CHIP-LED0805]  78.42,20.32 135 top
LED489  [CHIP-LED0805]  78.42,22.86 135 top
LED490  [CHIP-LED0805]  78.42,25.4 135 top
LED491  [CHIP-LED0805]  78.42,27.94 135 top
LED492  [CHIP-LED0805]  78.42,30.48 135 top
LED493  [CHIP-LED0805]  78.42,35.56 135 top
LED494  [CHIP-LED0805]  78.42,38.1 135 top
LED495  [CHIP-LED0805]  78.42,40.64 135 top
LED496  [CHIP-LED0805]  78.42,33.02 135 top
LED497  [CHIP-LED0805]  80.96,2.54 135 top
LED498  [CHIP-LED0805]  80.96,5.08 135 top
LED499  [CHIP-LED0805]  80.96,7.62 135 top
LED500  [CHIP-LED0805]  80.96,10.16 135 top
LED501  [CHIP-LED0805]  80.96,12.7 135 top
LED502  [CHIP-LED0805]  80.96,15.24 135 top
LED503  [CHIP-LED0805]  80.96,17.78 135 top
LED504  [CHIP-LED0805]  80.96,20.32 135 top
LED505  [CHIP-LED0805]  80.96,22.86 135 top
LED506  [CHIP-LED0805]  80.96,25.4 135 top
LED507  [CHIP-LED0805]  80.96,27.94 135 top
LED508  [CHIP-LED0805]  80.96,30.48 135 top
LED509  [CHIP-LED0805]  80.96,35.56 135 top
LED510  [CHIP-LED0805]  80.96,38.1 135 top
LED511  [CHIP-LED0805]  80.96,40.64 135 top
LED512  [CHIP-LED0805]  80.96,33.02 135 top
SV1  [ML64_K]  41.59,45.4 0 top

## Tracks (layer width: path | path; a pad name or v marks a point on that pad's centre or on a via)
COL1  (via drill 0.4)
  Top 0.305: v2.54,40.96 LED67.A 2.96,42.97 3.49,43.5 3.49,45.4 SV1.2 | v2.54,38.42 LED66.A | v2.54,35.88 LED65.A | v2.54,33.34 LED68.A | v2.54,30.8 LED36.A | v2.54,28.26 LED35.A | v2.54,25.72 LED34.A | v2.54,23.18 LED33.A | v2.54,20.64 LED20.A | v2.54,18.1 LED19.A | v2.54,15.56 LED18.A | v2.54,13.02 LED17.A | v2.54,10.48 LED4.A | v2.54,7.94 LED3.A | v2.54,5.4 LED2.A | LED1.A v2.54,2.86
  Bottom 0.305: v2.54,40.96 v2.54,38.42 v2.54,35.88 v2.54,33.34 v2.54,30.8 v2.54,28.26 v2.54,25.72 v2.54,23.18 v2.54,20.64 v2.54,18.1 v2.54,15.56 v2.54,13.02 v2.54,10.48 v2.54,7.94 v2.54,5.4 v2.54,2.86
COL2  (via drill 0.4)
  Top 0.305: v5.08,40.96 LED23.A 5.5,42.97 6.03,43.5 6.03,45.4 SV1.4 | v5.08,38.42 LED22.A | v5.08,35.88 LED21.A | v5.08,33.34 LED24.A | v5.08,30.8 LED16.A | v5.08,28.26 LED15.A | v5.08,25.72 LED14.A | v5.08,23.18 LED13.A | v5.08,20.64 LED12.A | v5.08,18.1 LED11.A | v5.08,15.56 LED10.A | v5.08,13.02 LED9.A | v5.08,10.48 LED8.A | v5.08,7.94 LED7.A | v5.08,5.4 LED6.A | LED5.A v5.08,2.86
  Bottom 0.305: v5.08,40.96 v5.08,38.42 v5.08,35.88 v5.08,33.34 v5.08,30.8 v5.08,28.26 v5.08,25.72 v5.08,23.18 v5.08,20.64 v5.08,18.1 v5.08,15.56 v5.08,13.02 v5.08,10.48 v5.08,7.94 v5.08,5.4 v5.08,2.86
COL3  (via drill 0.4)
  Top 0.305: v7.62,40.96 LED43.A 8.04,42.65 8.57,43.18 8.57,45.4 SV1.6 | v7.62,38.42 LED42.A | v7.62,35.88 LED41.A | v7.62,33.34 LED44.A | v7.62,30.8 LED40.A | v7.62,28.26 LED39.A | v7.62,25.72 LED38.A | v7.62,23.18 LED37.A | v7.62,20.64 LED32.A | v7.62,18.1 LED31.A | v7.62,15.56 LED30.A | v7.62,13.02 LED29.A | v7.62,10.48 LED28.A | v7.62,7.94 LED27.A | v7.62,5.4 LED26.A | LED25.A v7.62,2.86
  Bottom 0.305: v7.62,40.96 v7.62,38.42 v7.62,35.88 v7.62,33.34 v7.62,30.8 v7.62,28.26 v7.62,25.72 v7.62,23.18 v7.62,20.64 v7.62,18.1 v7.62,15.56 v7.62,13.02 v7.62,10.48 v7.62,7.94 v7.62,5.4 v7.62,2.86
COL4  (via drill 0.4)
  Top 0.305: v10.16,40.96 LED59.A 10.59,42.65 11.11,43.18 11.11,45.4 SV1.8 | v10.16,38.42 LED58.A | v10.16,35.88 LED57.A | v10.16,33.34 LED60.A | v10.16,30.8 LED56.A | v10.16,28.26 LED55.A | v10.16,25.72 LED54.A | v10.16,23.18 LED53.A | v10.16,20.64 LED52.A | v10.16,18.1 LED51.A | v10.16,15.56 LED50.A | v10.16,13.02 LED49.A | v10.16,10.48 LED48.A | v10.16,7.94 LED47.A | v10.16,5.4 LED46.A | LED45.A v10.16,2.86
  Bottom 0.305: v10.16,40.96 v10.16,38.42 v10.16,35.88 v10.16,33.34 v10.16,30.8 v10.16,28.26 v10.16,25.72 v10.16,23.18 v10.16,20.64 v10.16,18.1 v10.16,15.56 v10.16,13.02 v10.16,10.48 v10.16,7.94 v10.16,5.4 v10.16,2.86
COL5  (via drill 0.4)
  Top 0.305: v12.7,40.96 LED79.A 13.12,42.97 13.65,43.5 13.65,45.4 SV1.10 | v12.7,38.42 LED78.A | v12.7,35.88 LED77.A | v12.7,33.34 LED80.A | v12.7,30.8 LED76.A | v12.7,28.26 LED75.A | v12.7,25.72 LED74.A | v12.7,23.18 LED73.A | v12.7,20.64 LED72.A | v12.7,18.1 LED71.A | v12.7,15.56 LED70.A | v12.7,13.02 LED69.A | v12.7,10.48 LED64.A | v12.7,7.94 LED63.A | v12.7,5.4 LED62.A | LED61.A v12.7,2.86
  Bottom 0.305: v12.7,40.96 v12.7,38.42 v12.7,35.88 v12.7,33.34 v12.7,30.8 v12.7,28.26 v12.7,25.72 v12.7,23.18 v12.7,20.64 v12.7,18.1 v12.7,15.56 v12.7,13.02 v12.7,10.48 v12.7,7.94 v12.7,5.4 v12.7,2.86
COL6  (via drill 0.4)
  Top 0.305: v15.24,40.96 LED95.A 15.67,42.65 16.19,43.18 16.19,45.4 SV1.12 | v15.24,38.42 LED94.A | v15.24,35.88 LED93.A | v15.24,33.34 LED96.A | v15.24,30.8 LED92.A | v15.24,28.26 LED91.A | v15.24,25.72 LED90.A | v15.24,23.18 LED89.A | v15.24,20.64 LED88.A | v15.24,18.1 LED87.A | v15.24,15.56 LED86.A | v15.24,13.02 LED85.A | v15.24,10.48 LED84.A | v15.24,7.94 LED83.A | v15.24,5.4 LED82.A | LED81.A v15.24,2.86
  Bottom 0.305: v15.24,40.96 v15.24,38.42 v15.24,35.88 v15.24,33.34 v15.24,30.8 v15.24,28.26 v15.24,25.72 v15.24,23.18 v15.24,20.64 v15.24,18.1 v15.24,15.56 v15.24,13.02 v15.24,10.48 v15.24,7.94 v15.24,5.4 v15.24,2.86
COL7  (via drill 0.4)
  Top 0.305: v17.78,40.96 LED111.A 18.2,42.34 18.73,42.86 18.73,45.4 SV1.14 | v17.78,38.42 LED110.A | v17.78,35.88 LED109.A | v17.78,33.34 LED112.A | v17.78,30.8 LED108.A | v17.78,28.26 LED107.A | v17.78,25.72 LED106.A | v17.78,23.18 LED105.A | v17.78,20.64 LED104.A | v17.78,18.1 LED103.A | v17.78,15.56 LED102.A | v17.78,13.02 LED101.A | v17.78,10.48 LED100.A | v17.78,7.94 LED99.A | v17.78,5.4 LED98.A | LED97.A v17.78,2.86
  Bottom 0.305: v17.78,40.96 v17.78,38.42 v17.78,35.88 v17.78,33.34 v17.78,30.8 v17.78,28.26 v17.78,25.72 v17.78,23.18 v17.78,20.64 v17.78,18.1 v17.78,15.56 v17.78,13.02 v17.78,10.48 v17.78,7.94 v17.78,5.4 v17.78,2.86
COL8  (via drill 0.4)
  Top 0.305: v20.32,40.96 LED127.A 20.74,42.34 21.27,42.86 21.27,45.4 SV1.16 | v20.32,38.42 LED126.A | v20.32,35.88 LED125.A | v20.32,33.34 LED128.A | v20.32,30.8 LED124.A | v20.32,28.26 LED123.A | v20.32,25.72 LED122.A | v20.32,23.18 LED121.A | v20.32,20.64 LED120.A | v20.32,18.1 LED119.A | v20.32,15.56 LED118.A | v20.32,13.02 LED117.A | v20.32,10.48 LED116.A | v20.32,7.94 LED115.A | v20.32,5.4 LED114.A | LED113.A v20.32,2.86
  Bottom 0.305: v20.32,40.96 v20.32,38.42 v20.32,35.88 v20.32,33.34 v20.32,30.8 v20.32,28.26 v20.32,25.72 v20.32,23.18 v20.32,20.64 v20.32,18.1 v20.32,15.56 v20.32,13.02 v20.32,10.48 v20.32,7.94 v20.32,5.4 v20.32,2.86
COL9  (via drill 0.4)
  Top 0.305: v22.86,40.96 LED143.A 23.28,42.34 23.81,42.86 23.81,45.4 SV1.18 | v22.86,38.42 LED142.A | v22.86,35.88 LED141.A | v22.86,33.34 LED144.A | v22.86,30.8 LED140.A | v22.86,28.26 LED139.A | v22.86,25.72 LED138.A | v22.86,23.18 LED137.A | v22.86,20.64 LED136.A | v22.86,18.1 LED135.A | v22.86,15.56 LED134.A | v22.86,13.02 LED133.A | v22.86,10.48 LED132.A | v22.86,7.94 LED131.A | v22.86,5.4 LED130.A | LED129.A v22.86,2.86
  Bottom 0.305: v22.86,40.96 v22.86,38.42 v22.86,35.88 v22.86,33.34 v22.86,30.8 v22.86,28.26 v22.86,25.72 v22.86,23.18 v22.86,20.64 v22.86,18.1 v22.86,15.56 v22.86,13.02 v22.86,10.48 v22.86,7.94 v22.86,5.4 v22.86,2.86
COL10  (via drill 0.4)
  Top 0.305: v25.4,40.96 LED159.A 25.83,42.34 26.35,42.86 26.35,45.4 SV1.20 | v25.4,38.42 LED158.A | v25.4,35.88 LED157.A | v25.4,33.34 LED160.A | v25.4,30.8 LED156.A | v25.4,28.26 LED155.A | v25.4,25.72 LED154.A | v25.4,23.18 LED153.A | v25.4,20.64 LED152.A | v25.4,18.1 LED151.A | v25.4,15.56 LED150.A | v25.4,13.02 LED149.A | v25.4,10.48 LED148.A | v25.4,7.94 LED147.A | v25.4,5.4 LED146.A | LED145.A v25.4,2.86
  Bottom 0.305: v25.4,40.96 v25.4,38.42 v25.4,35.88 v25.4,33.34 v25.4,30.8 v25.4,28.26 v25.4,25.72 v25.4,23.18 v25.4,20.64 v25.4,18.1 v25.4,15.56 v25.4,13.02 v25.4,10.48 v25.4,7.94 v25.4,5.4 v25.4,2.86
COL11  (via drill 0.4)
  Top 0.305: v27.94,40.96 LED175.A 28.37,42.34 28.89,42.86 28.89,45.4 SV1.22 | v27.94,38.42 LED174.A | v27.94,35.88 LED173.A | v27.94,33.34 LED176.A | v27.94,30.8 LED172.A | v27.94,28.26 LED171.A | v27.94,25.72 LED170.A | v27.94,23.18 LED169.A | v27.94,20.64 LED168.A | v27.94,18.1 LED167.A | v27.94,15.56 LED166.A | v27.94,13.02 LED165.A | v27.94,10.48 LED164.A | v27.94,7.94 LED163.A | v27.94,5.4 LED162.A | LED161.A v27.94,2.86
  Bottom 0.305: v27.94,40.96 v27.94,38.42 v27.94,35.88 v27.94,33.34 v27.94,30.8 v27.94,28.26 v27.94,25.72 v27.94,23.18 v27.94,20.64 v27.94,18.1 v27.94,15.56 v27.94,13.02 v27.94,10.48 v27.94,7.94 v27.94,5.4 v27.94,2.86
COL12  (via drill 0.4)
  Top 0.305: v30.48,40.96 LED191.A 30.91,42.34 31.43,42.86 31.43,45.4 SV1.24 | v30.48,38.42 LED190.A | v30.48,35.88 LED189.A | v30.48,33.34 LED192.A | v30.48,30.8 LED188.A | v30.48,28.26 LED187.A | v30.48,25.72 LED186.A | v30.48,23.18 LED185.A | v30.48,20.64 LED184.A | v30.48,18.1 LED183.A | v30.48,15.56 LED182.A | v30.48,13.02 LED181.A | v30.48,10.48 LED180.A | v30.48,7.94 LED179.A | v30.48,5.4 LED178.A | LED177.A v30.48,2.86
  Bottom 0.305: v30.48,40.96 v30.48,38.42 v30.48,35.88 v30.48,33.34 v30.48,30.8 v30.48,28.26 v30.48,25.72 v30.48,23.18 v30.48,20.64 v30.48,18.1 v30.48,15.56 v30.48,13.02 v30.48,10.48 v30.48,7.94 v30.48,5.4 v30.48,2.86
COL13  (via drill 0.4)
  Top 0.305: v33.02,40.96 LED207.A 33.45,42.34 33.97,42.86 33.97,45.4 SV1.26 | v33.02,38.42 LED206.A | v33.02,35.88 LED205.A | v33.02,33.34 LED208.A | v33.02,30.8 LED204.A | v33.02,28.26 LED203.A | v33.02,25.72 LED202.A | v33.02,23.18 LED201.A | v33.02,20.64 LED200.A | v33.02,18.1 LED199.A | v33.02,15.56 LED198.A | v33.02,13.02 LED197.A | v33.02,10.48 LED196.A | v33.02,7.94 LED195.A | v33.02,5.4 LED194.A | LED193.A v33.02,2.86
  Bottom 0.305: v33.02,40.96 v33.02,38.42 v33.02,35.88 v33.02,33.34 v33.02,30.8 v33.02,28.26 v33.02,25.72 v33.02,23.18 v33.02,20.64 v33.02,18.1 v33.02,15.56 v33.02,13.02 v33.02,10.48 v33.02,7.94 v33.02,5.4 v33.02,2.86
COL14  (via drill 0.4)
  Top 0.305: v35.56,40.96 LED223.A 35.98,42.65 36.51,43.18 36.51,45.4 SV1.28 | v35.56,38.42 LED222.A | v35.56,35.88 LED221.A | v35.56,33.34 LED224.A | v35.56,30.8 LED220.A | v35.56,28.26 LED219.A | v35.56,25.72 LED218.A | v35.56,23.18 LED217.A | v35.56,20.64 LED216.A | v35.56,18.1 LED215.A | v35.56,15.56 LED214.A | v35.56,13.02 LED213.A | v35.56,10.48 LED212.A | v35.56,7.94 LED211.A | v35.56,5.4 LED210.A | LED209.A v35.56,2.86
  Bottom 0.305: v35.56,40.96 v35.56,38.42 v35.56,35.88 v35.56,33.34 v35.56,30.8 v35.56,28.26 v35.56,25.72 v35.56,23.18 v35.56,20.64 v35.56,18.1 v35.56,15.56 v35.56,13.02 v35.56,10.48 v35.56,7.94 v35.56,5.4 v35.56,2.86
COL15  (via drill 0.4)
  Top 0.305: v38.1,40.96 LED239.A 38.52,42.65 39.05,43.18 39.05,45.4 SV1.30 | v38.1,38.42 LED238.A | v38.1,35.88 LED237.A | v38.1,33.34 LED240.A | v38.1,30.8 LED236.A | v38.1,28.26 LED235.A | v38.1,25.72 LED234.A | v38.1,23.18 LED233.A | v38.1,20.64 LED232.A | v38.1,18.1 LED231.A | v38.1,15.56 LED230.A | v38.1,13.02 LED229.A | v38.1,10.48 LED228.A | v38.1,7.94 LED227.A | v38.1,5.4 LED226.A | LED225.A v38.1,2.86
  Bottom 0.305: v38.1,40.96 v38.1,38.42 v38.1,35.88 v38.1,33.34 v38.1,30.8 v38.1,28.26 v38.1,25.72 v38.1,23.18 v38.1,20.64 v38.1,18.1 v38.1,15.56 v38.1,13.02 v38.1,10.48 v38.1,7.94 v38.1,5.4 v38.1,2.86
COL16  (via drill 0.4)
  Top 0.305: v40.64,40.96 LED255.A 41.06,42.65 41.59,43.18 41.59,45.4 SV1.32 | v40.64,38.42 LED254.A | v40.64,35.88 LED253.A | v40.64,33.34 LED256.A | v40.64,30.8 LED252.A | v40.64,28.26 LED251.A | v40.64,25.72 LED250.A | v40.64,23.18 LED249.A | v40.64,20.64 LED248.A | v40.64,18.1 LED247.A | v40.64,15.56 LED246.A | v40.64,13.02 LED245.A | v40.64,10.48 LED244.A | v40.64,7.94 LED243.A | v40.64,5.4 LED242.A | LED241.A v40.64,2.86
  Bottom 0.305: v40.64,40.96 v40.64,38.42 v40.64,35.88 v40.64,33.34 v40.64,30.8 v40.64,28.26 v40.64,25.72 v40.64,23.18 v40.64,20.64 v40.64,18.1 v40.64,15.56 v40.64,13.02 v40.64,10.48 v40.64,7.94 v40.64,5.4 v40.64,2.86
COL17  (via drill 0.4)
  Top 0.305: v43.18,40.96 LED271.A 43.6,42.65 44.13,43.18 44.13,45.4 SV1.34 | v43.18,38.42 LED270.A | v43.18,35.88 LED269.A | v43.18,33.34 LED272.A | v43.18,30.8 LED268.A | v43.18,28.26 LED267.A | v43.18,25.72 LED266.A | v43.18,23.18 LED265.A | v43.18,20.64 LED264.A | v43.18,18.1 LED263.A | v43.18,15.56 LED262.A | v43.18,13.02 LED261.A | v43.18,10.48 LED260.A | v43.18,7.94 LED259.A | v43.18,5.4 LED258.A | LED257.A v43.18,2.86
  Bottom 0.305: v43.18,40.96 v43.18,38.42 v43.18,35.88 v43.18,33.34 v43.18,30.8 v43.18,28.26 v43.18,25.72 v43.18,23.18 v43.18,20.64 v43.18,18.1 v43.18,15.56 v43.18,13.02 v43.18,10.48 v43.18,7.94 v43.18,5.4 v43.18,2.86
COL18  (via drill 0.4)
  Top 0.305: v45.72,40.96 LED287.A 46.14,42.65 46.67,43.18 46.67,45.4 SV1.36 | v45.72,38.42 LED286.A | v45.72,35.88 LED285.A | v45.72,33.34 LED288.A | v45.72,30.8 LED284.A | v45.72,28.26 LED283.A | v45.72,25.72 LED282.A | v45.72,23.18 LED281.A | v45.72,20.64 LED280.A | v45.72,18.1 LED279.A | v45.72,15.56 LED278.A | v45.72,13.02 LED277.A | v45.72,10.48 LED276.A | v45.72,7.94 LED275.A | v45.72,5.4 LED274.A | LED273.A v45.72,2.86
  Bottom 0.305: v45.72,40.96 v45.72,38.42 v45.72,35.88 v45.72,33.34 v45.72,30.8 v45.72,28.26 v45.72,25.72 v45.72,23.18 v45.72,20.64 v45.72,18.1 v45.72,15.56 v45.72,13.02 v45.72,10.48 v45.72,7.94 v45.72,5.4 v45.72,2.86
COL19  (via drill 0.4)
  Top 0.305: v48.26,40.96 LED303.A 48.68,42.65 49.21,43.18 49.21,45.4 SV1.38 | v48.26,38.42 LED302.A | v48.26,35.88 LED301.A | v48.26,33.34 LED304.A | v48.26,30.8 LED300.A | v48.26,28.26 LED299.A | v48.26,25.72 LED298.A | v48.26,23.18 LED297.A | v48.26,20.64 LED296.A | v48.26,18.1 LED295.A | v48.26,15.56 LED294.A | v48.26,13.02 LED293.A | v48.26,10.48 LED292.A | v48.26,7.94 LED291.A | v48.26,5.4 LED290.A | LED289.A v48.26,2.86
  Bottom 0.305: v48.26,40.96 v48.26,38.42 v48.26,35.88 v48.26,33.34 v48.26,30.8 v48.26,28.26 v48.26,25.72 v48.26,23.18 v48.26,20.64 v48.26,18.1 v48.26,15.56 v48.26,13.02 v48.26,10.48 v48.26,7.94 v48.26,5.4 v48.26,2.86
COL20  (via drill 0.4)
  Top 0.305: v50.8,40.96 LED319.A 51.23,42.65 51.75,43.18 51.75,45.4 SV1.40 | v50.8,38.42 LED318.A | v50.8,35.88 LED317.A | v50.8,33.34 LED320.A | v50.8,30.8 LED316.A | v50.8,28.26 LED315.A | v50.8,25.72 LED314.A | v50.8,23.18 LED313.A | v50.8,20.64 LED312.A | v50.8,18.1 LED311.A | v50.8,15.56 LED310.A | v50.8,13.02 LED309.A | v50.8,10.48 LED308.A | v50.8,7.94 LED307.A | v50.8,5.4 LED306.A | LED305.A v50.8,2.86
  Bottom 0.305: v50.8,40.96 v50.8,38.42 v50.8,35.88 v50.8,33.34 v50.8,30.8 v50.8,28.26 v50.8,25.72 v50.8,23.18 v50.8,20.64 v50.8,18.1 v50.8,15.56 v50.8,13.02 v50.8,10.48 v50.8,7.94 v50.8,5.4 v50.8,2.86
COL21  (via drill 0.4)
  Top 0.305: v53.34,40.96 LED335.A 53.77,42.65 54.29,43.18 54.29,45.4 SV1.42 | v53.34,38.42 LED334.A | v53.34,35.88 LED333.A | v53.34,33.34 LED336.A | v53.34,30.8 LED332.A | v53.34,28.26 LED331.A | v53.34,25.72 LED330.A | v53.34,23.18 LED329.A | v53.34,20.64 LED328.A | v53.34,18.1 LED327.A | v53.34,15.56 LED326.A | v53.34,13.02 LED325.A | v53.34,10.48 LED324.A | v53.34,7.94 LED323.A | v53.34,5.4 LED322.A | LED321.A v53.34,2.86
  Bottom 0.305: v53.34,40.96 v53.34,38.42 v53.34,35.88 v53.34,33.34 v53.34,30.8 v53.34,28.26 v53.34,25.72 v53.34,23.18 v53.34,20.64 v53.34,18.1 v53.34,15.56 v53.34,13.02 v53.34,10.48 v53.34,7.94 v53.34,5.4 v53.34,2.86
COL22  (via drill 0.4)
  Top 0.305: v55.88,40.96 LED351.A 56.3,42.65 56.83,43.18 56.83,45.4 SV1.44 | v55.88,38.42 LED350.A | v55.88,35.88 LED349.A | v55.88,33.34 LED352.A | v55.88,30.8 LED348.A | v55.88,28.26 LED347.A | v55.88,25.72 LED346.A | v55.88,23.18 LED345.A | v55.88,20.64 LED344.A | v55.88,18.1 LED343.A | v55.88,15.56 LED342.A | v55.88,13.02 LED341.A | v55.88,10.48 LED340.A | v55.88,7.94 LED339.A | v55.88,5.4 LED338.A | LED337.A v55.88,2.86
  Bottom 0.305: v55.88,40.96 v55.88,38.42 v55.88,35.88 v55.88,33.34 v55.88,30.8 v55.88,28.26 v55.88,25.72 v55.88,23.18 v55.88,20.64 v55.88,18.1 v55.88,15.56 v55.88,13.02 v55.88,10.48 v55.88,7.94 v55.88,5.4 v55.88,2.86
COL23  (via drill 0.4)
  Top 0.305: v58.42,40.96 LED367.A 58.84,42.65 59.37,43.18 59.37,45.4 SV1.46 | v58.42,38.42 LED366.A | v58.42,35.88 LED365.A | v58.42,33.34 LED368.A | v58.42,30.8 LED364.A | v58.42,28.26 LED363.A | v58.42,25.72 LED362.A | v58.42,23.18 LED361.A | v58.42,20.64 LED360.A | v58.42,18.1 LED359.A | v58.42,15.56 LED358.A | v58.42,13.02 LED357.A | v58.42,10.48 LED356.A | v58.42,7.94 LED355.A | v58.42,5.4 LED354.A | LED353.A v58.42,2.86
  Bottom 0.305: v58.42,40.96 v58.42,38.42 v58.42,35.88 v58.42,33.34 v58.42,30.8 v58.42,28.26 v58.42,25.72 v58.42,23.18 v58.42,20.64 v58.42,18.1 v58.42,15.56 v58.42,13.02 v58.42,10.48 v58.42,7.94 v58.42,5.4 v58.42,2.86
COL24  (via drill 0.4)
  Top 0.305: v60.96,40.96 LED383.A 61.38,42.65 61.91,43.18 61.91,45.4 SV1.48 | v60.96,38.42 LED382.A | v60.96,35.88 LED381.A | v60.96,33.34 LED384.A | v60.96,30.8 LED380.A | v60.96,28.26 LED379.A | v60.96,25.72 LED378.A | v60.96,23.18 LED377.A | v60.96,20.64 LED376.A | v60.96,18.1 LED375.A | v60.96,15.56 LED374.A | v60.96,13.02 LED373.A | v60.96,10.48 LED372.A | v60.96,7.94 LED371.A | v60.96,5.4 LED370.A | LED369.A v60.96,2.86
  Bottom 0.305: v60.96,40.96 v60.96,38.42 v60.96,35.88 v60.96,33.34 v60.96,30.8 v60.96,28.26 v60.96,25.72 v60.96,23.18 v60.96,20.64 v60.96,18.1 v60.96,15.56 v60.96,13.02 v60.96,10.48 v60.96,7.94 v60.96,5.4 v60.96,2.86
COL25  (via drill 0.4)
  Top 0.305: v63.5,40.96 LED399.A 63.92,42.65 64.45,43.18 64.45,45.4 SV1.50 | v63.5,38.42 LED398.A | v63.5,35.88 LED397.A | v63.5,33.34 LED400.A | v63.5,30.8 LED396.A | v63.5,28.26 LED395.A | v63.5,25.72 LED394.A | v63.5,23.18 LED393.A | v63.5,20.64 LED392.A | v63.5,18.1 LED391.A | v63.5,15.56 LED390.A | v63.5,13.02 LED389.A | v63.5,10.48 LED388.A | v63.5,7.94 LED387.A | v63.5,5.4 LED386.A | LED385.A v63.5,2.86
  Bottom 0.305: v63.5,40.96 v63.5,38.42 v63.5,35.88 v63.5,33.34 v63.5,30.8 v63.5,28.26 v63.5,25.72 v63.5,23.18 v63.5,20.64 v63.5,18.1 v63.5,15.56 v63.5,13.02 v63.5,10.48 v63.5,7.94 v63.5,5.4 v63.5,2.86
COL26  (via drill 0.4)
  Top 0.305: v66.04,40.96 LED415.A 66.47,42.65 66.99,43.18 66.99,45.4 SV1.52 | v66.04,38.42 LED414.A | v66.04,35.88 LED413.A | v66.04,33.34 LED416.A | v66.04,30.8 LED412.A | v66.04,28.26 LED411.A | v66.04,25.72 LED410.A | v66.04,23.18 LED409.A | v66.04,20.64 LED408.A | v66.04,18.1 LED407.A | v66.04,15.56 LED406.A | v66.04,13.02 LED405.A | v66.04,10.48 LED404.A | v66.04,7.94 LED403.A | v66.04,5.4 LED402.A | LED401.A v66.04,2.86
  Bottom 0.305: v66.04,40.96 v66.04,38.42 v66.04,35.88 v66.04,33.34 v66.04,30.8 v66.04,28.26 v66.04,25.72 v66.04,23.18 v66.04,20.64 v66.04,18.1 v66.04,15.56 v66.04,13.02 v66.04,10.48 v66.04,7.94 v66.04,5.4 v66.04,2.86
COL27  (via drill 0.4)
  Top 0.305: v68.58,40.96 LED431.A 69,42.65 69.53,43.18 69.53,45.4 SV1.54 | v68.58,38.42 LED430.A | v68.58,35.88 LED429.A | v68.58,33.34 LED432.A | v68.58,30.8 LED428.A | v68.58,28.26 LED427.A | v68.58,25.72 LED426.A | v68.58,23.18 LED425.A | v68.58,20.64 LED424.A | v68.58,18.1 LED423.A | v68.58,15.56 LED422.A | v68.58,13.02 LED421.A | v68.58,10.48 LED420.A | v68.58,7.94 LED419.A | v68.58,5.4 LED418.A | LED417.A v68.58,2.86
  Bottom 0.305: v68.58,40.96 v68.58,38.42 v68.58,35.88 v68.58,33.34 v68.58,30.8 v68.58,28.26 v68.58,25.72 v68.58,23.18 v68.58,20.64 v68.58,18.1 v68.58,15.56 v68.58,13.02 v68.58,10.48 v68.58,7.94 v68.58,5.4 v68.58,2.86
COL28  (via drill 0.4)
  Top 0.305: v71.12,40.96 LED447.A 71.55,42.65 72.07,43.18 72.07,45.4 SV1.56 | v71.12,38.42 LED446.A | v71.12,35.88 LED445.A | v71.12,33.34 LED448.A | v71.12,30.8 LED444.A | v71.12,28.26 LED443.A | v71.12,25.72 LED442.A | v71.12,23.18 LED441.A | v71.12,20.64 LED440.A | v71.12,18.1 LED439.A | v71.12,15.56 LED438.A | v71.12,13.02 LED437.A | v71.12,10.48 LED436.A | v71.12,7.94 LED435.A | v71.12,5.4 LED434.A | LED433.A v71.12,2.86
  Bottom 0.305: v71.12,40.96 v71.12,38.42 v71.12,35.88 v71.12,33.34 v71.12,30.8 v71.12,28.26 v71.12,25.72 v71.12,23.18 v71.12,20.64 v71.12,18.1 v71.12,15.56 v71.12,13.02 v71.12,10.48 v71.12,7.94 v71.12,5.4 v71.12,2.86
COL29  (via drill 0.4)
  Top 0.305: v73.66,40.96 LED463.A 74.08,42.65 74.61,43.18 74.61,45.4 SV1.58 | v73.66,38.42 LED462.A | v73.66,35.88 LED461.A | v73.66,33.34 LED464.A | v73.66,30.8 LED460.A | v73.66,28.26 LED459.A | v73.66,25.72 LED458.A | v73.66,23.18 LED457.A | v73.66,20.64 LED456.A | v73.66,18.1 LED455.A | v73.66,15.56 LED454.A | v73.66,13.02 LED453.A | v73.66,10.48 LED452.A | v73.66,7.94 LED451.A | v73.66,5.4 LED450.A | LED449.A v73.66,2.86
  Bottom 0.305: v73.66,40.96 v73.66,38.42 v73.66,35.88 v73.66,33.34 v73.66,30.8 v73.66,28.26 v73.66,25.72 v73.66,23.18 v73.66,20.64 v73.66,18.1 v73.66,15.56 v73.66,13.02 v73.66,10.48 v73.66,7.94 v73.66,5.4 v73.66,2.86
COL30  (via drill 0.4)
  Top 0.305: v76.2,40.96 LED479.A 76.62,42.65 77.15,43.18 77.15,45.4 SV1.60 | v76.2,38.42 LED478.A | v76.2,35.88 LED477.A | v76.2,33.34 LED480.A | v76.2,30.8 LED476.A | v76.2,28.26 LED475.A | v76.2,25.72 LED474.A | v76.2,23.18 LED473.A | v76.2,20.64 LED472.A | v76.2,18.1 LED471.A | v76.2,15.56 LED470.A | v76.2,13.02 LED469.A | v76.2,10.48 LED468.A | v76.2,7.94 LED467.A | v76.2,5.4 LED466.A | LED465.A v76.2,2.86
  Bottom 0.305: v76.2,40.96 v76.2,38.42 v76.2,35.88 v76.2,33.34 v76.2,30.8 v76.2,28.26 v76.2,25.72 v76.2,23.18 v76.2,20.64 v76.2,18.1 v76.2,15.56 v76.2,13.02 v76.2,10.48 v76.2,7.94 v76.2,5.4 v76.2,2.86
COL31  (via drill 0.4)
  Top 0.305: v78.74,40.96 LED495.A 79.16,42.65 79.69,43.18 79.69,45.4 SV1.62 | v78.74,38.42 LED494.A | v78.74,35.88 LED493.A | v78.74,33.34 LED496.A | v78.74,30.8 LED492.A | v78.74,28.26 LED491.A | v78.74,25.72 LED490.A | v78.74,23.18 LED489.A | v78.74,20.64 LED488.A | v78.74,18.1 LED487.A | v78.74,15.56 LED486.A | v78.74,13.02 LED485.A | v78.74,10.48 LED484.A | v78.74,7.94 LED483.A | v78.74,5.4 LED482.A | LED481.A v78.74,2.86
  Bottom 0.305: v78.74,40.96 v78.74,38.42 v78.74,35.88 v78.74,33.34 v78.74,30.8 v78.74,28.26 v78.74,25.72 v78.74,23.18 v78.74,20.64 v78.74,18.1 v78.74,15.56 v78.74,13.02 v78.74,10.48 v78.74,7.94 v78.74,5.4 v78.74,2.86
COL32  (via drill 0.4)
  Top 0.305: v81.28,40.96 LED511.A 81.7,42.65 82.23,43.18 82.23,45.4 SV1.64 | v81.28,38.42 LED510.A | v81.28,35.88 LED509.A | v81.28,33.34 LED512.A | v81.28,30.8 LED508.A | v81.28,28.26 LED507.A | v81.28,25.72 LED506.A | v81.28,23.18 LED505.A | v81.28,20.64 LED504.A | v81.28,18.1 LED503.A | v81.28,15.56 LED502.A | v81.28,13.02 LED501.A | v81.28,10.48 LED500.A | v81.28,7.94 LED499.A | v81.28,5.4 LED498.A | LED497.A v81.28,2.86
  Bottom 0.305: v81.28,40.96 v81.28,38.42 v81.28,35.88 v81.28,33.34 v81.28,30.8 v81.28,28.26 v81.28,25.72 v81.28,23.18 v81.28,20.64 v81.28,18.1 v81.28,15.56 v81.28,13.02 v81.28,10.48 v81.28,7.94 v81.28,5.4 v81.28,2.86
ROW1  (via drill 0.4)
  Top 0.305: LED68.C 1.59,32.28 1.59,32.38 4.13,32.38 | 4.13,32.38 6.35,32.38 | 6.35,32.38 8.89,32.38 | 8.89,32.38 11.75,32.38 | 11.75,32.38 14.29,32.38 | 14.29,32.38 16.83,32.38 | 16.83,32.38 19.37,32.38 | 19.37,32.38 21.59,32.38 | 21.59,32.38 24.45,32.38 | 24.45,32.38 26.67,32.38 | 26.67,32.38 29.21,32.38 | 29.21,32.38 32.07,32.38 | 32.07,32.38 34.61,32.38 | 34.61,32.38 37.15,32.38 | 37.15,32.38 39.58,32.38 LED256.C 39.9,32.28 40,32.38 42.01,32.38 LED272.C 42.23,32.28 42.23,32.38 44.77,32.38 | LED24.C 4.13,32.28 4.13,32.38 | LED44.C 6.35,32.28 6.35,32.38 | LED60.C 8.89,32.28 8.89,32.38 | LED80.C 11.75,32.28 11.75,32.38 | LED96.C 14.29,32.28 14.29,32.38 | LED112.C 16.83,32.28 16.83,32.38 | LED128.C 19.37,32.28 19.37,32.38 | LED144.C 21.59,32.28 21.59,32.38 | LED160.C 24.45,32.28 24.45,32.38 | LED176.C 26.67,32.28 26.67,32.38 | LED192.C 29.21,32.28 29.21,32.38 | LED208.C 32.07,32.28 32.07,32.38 | LED224.C 34.61,32.28 34.61,32.38 | LED240.C 37.15,32.28 37.15,32.38 | 44.77,32.38 46.99,32.38 | 46.99,32.38 49.53,32.38 | 49.53,32.38 52.39,32.38 | 52.39,32.38 54.93,32.38 | 54.93,32.38 57.47,32.38 | 57.47,32.38 60.01,32.38 | 60.01,32.38 62.23,32.38 | 62.23,32.38 65.09,32.38 | 65.09,32.38 67.31,32.38 | 67.31,32.38 69.85,32.38 | 69.85,32.38 72.71,32.38 | 72.71,32.38 75.25,32.38 | 75.25,32.38 77.79,32.38 | 77.79,32.38 80.22,32.38 LED512.C | LED288.C 44.77,32.28 44.77,32.38 | LED304.C 46.99,32.28 46.99,32.38 | LED320.C 49.53,32.28 49.53,32.38 | LED336.C 52.39,32.28 52.39,32.38 | LED352.C 54.93,32.28 54.93,32.38 | LED368.C 57.47,32.28 57.47,32.38 | LED384.C 60.01,32.28 60.01,32.38 | LED400.C 62.23,32.28 62.23,32.38 | LED416.C 65.09,32.28 65.09,32.38 | LED432.C 67.31,32.28 67.31,32.38
  Top 0.305: LED448.C 69.85,32.28 69.85,32.38 | LED464.C 72.71,32.28 72.71,32.38 | LED480.C 75.25,32.28 75.25,32.38 | LED496.C 77.79,32.28 77.79,32.38 | 8.89,32.38 8.89,32.7 v9.21,33.02 | 72.71,32.38 v72.71,33.02
  Bottom 0.305: v9.21,33.02 9.21,43.5 SV1.7 | v72.71,33.02 72.71,43.5 SV1.57
ROW2  (via drill 0.4)
  Top 0.305: 39.69,40.01 LED255.C 39.69,39.9 | 1.59,40.01 LED67.C 1.48,40.01 | 4.13,40.01 LED23.C 4.13,39.9 4.13,40.01 | 6.67,40.01 LED43.C | 11.75,40.01 LED79.C 11.75,39.9 11.75,40.01 | 9.21,40.01 LED59.C | 14.29,40.01 LED95.C | 16.83,40.01 LED111.C | 19.37,40.01 LED127.C 19.05,39.9 19.05,40.01 | 21.91,40.01 LED143.C | 24.45,40.01 LED159.C | 26.99,40.01 LED175.C | 29.53,40.01 LED191.C | 32.07,40.01 LED207.C 32.07,39.9 32.07,40.01 | 34.61,40.01 LED223.C 34.61,39.9 34.61,40.01 | 37.15,40.01 LED239.C 37.15,39.9 37.15,40.01 | 39.69,40.01 39.69,39.9 | 1.48,40.01 4.13,40.01 | 29.53,40.01 32.07,40.01 | 32.07,40.01 34.61,40.01 | 34.61,40.01 37.15,40.01 | 37.15,40.01 39.69,40.01 | 37.15,40.01 37.15,40.32 | 26.99,40.01 29.53,40.01 | 24.45,40.01 26.99,40.01 | 4.13,40.01 6.67,40.01 | 6.67,40.01 8.89,40.01 | 9.21,40.01 11.75,40.01 | 16.83,40.01 19.05,40.01 | 21.91,40.01 24.45,40.01 | 8.89,40.01 9.21,40.01 | 8.89,40.01 8.89,39.69 9.21,39.69 9.21,40.01 | 6.67,40.01 6.67,39.37 | 11.75,40.01 14.29,40.01 | 14.29,40.01 16.83,40.01 | 19.05,40.01 21.91,40.01 | 80.33,40.01 LED511.C 80.33,39.9 80.33,40.01 | LED271.C 42.23,40.01 | 44.77,40.01 LED287.C 44.77,39.9 44.77,40.01 | 47.31,40.01 LED303.C | 52.39,40.01 LED335.C 52.39,39.9 52.39,40.01 | 49.85,40.01 LED319.C | 54.93,40.01 LED351.C | 57.47,40.01 LED367.C | 60.01,40.01 LED383.C 59.69,39.9 59.69,40.01 | 62.55,40.01 LED399.C | 65.09,40.01 LED415.C | 67.63,40.01 LED431.C | 70.17,40.01 LED447.C | 72.71,40.01 LED463.C 72.71,39.9 72.71,40.01 | 75.25,40.01 LED479.C 75.25,39.9 75.25,40.01 | 77.79,40.01 LED495.C 77.79,39.9 77.79,40.01 | 44.77,40.01 42.12,40.01 LED271.C | 70.17,40.01 72.71,40.01 | 72.71,40.01 75.25,40.01 | 75.25,40.01 77.79,40.01
  Top 0.305: 77.79,40.01 80.33,40.01 | 77.79,40.01 77.79,40.32 | 67.63,40.01 70.17,40.01 | 65.09,40.01 67.63,40.01 | 44.77,40.01 47.31,40.01 | 47.31,40.01 49.53,40.01 | 49.85,40.01 52.39,40.01 | 57.47,40.01 59.69,40.01 | 62.55,40.01 65.09,40.01 | 49.53,40.01 49.85,40.01 | 49.53,40.01 49.53,39.69 49.85,39.69 49.85,40.01 | 47.31,40.01 47.31,39.37 | 52.39,40.01 54.93,40.01 | 54.93,40.01 57.47,40.01 | 59.69,40.01 62.55,40.01 | 39.69,39.9 39.9,39.9 40,40.01 42.01,40.01 LED271.C | 1.48,40.01 1.48,43.39 SV1.1 | 80.33,40.01 v80.33,40.64
  Bottom 0.305: v80.33,40.64 80.33,43.5 SV1.63
ROW3  (via drill 0.4)